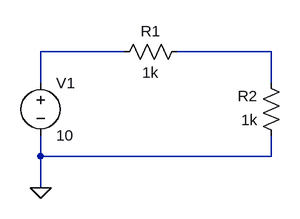
[diagram p0: schematic Draft3.asc]
Draft3.asc, the LTspice schematic file:
Version 4.1
SHEET 1 880 680
WIRE 112 112 -16 112
WIRE 336 112 192 112
WIRE -16 160 -16 112
WIRE 336 160 336 112
WIRE -16 272 -16 240
WIRE 336 272 336 240
WIRE 336 272 -16 272
WIRE -16 320 -16 272
FLAG -16 320 0
SYMBOL res 208 96 R90
WINDOW 0 0 56 VBottom 2
WINDOW 3 32 56 VTop 2
SYMATTR InstName R1
SYMATTR Value 1k
SYMBOL res 352 256 R180
WINDOW 0 36 76 Left 2
WINDOW 3 36 40 Left 2
SYMATTR InstName R2
SYMATTR Value 1k
SYMBOL voltage -16 144 R0
SYMATTR InstName V1
SYMATTR Value 10

The netlist it stands for:
* Draft3.asc
R1 N002 N001 1k
R2 0 N002 1k
V1 N001 0 10
.backanno
.end